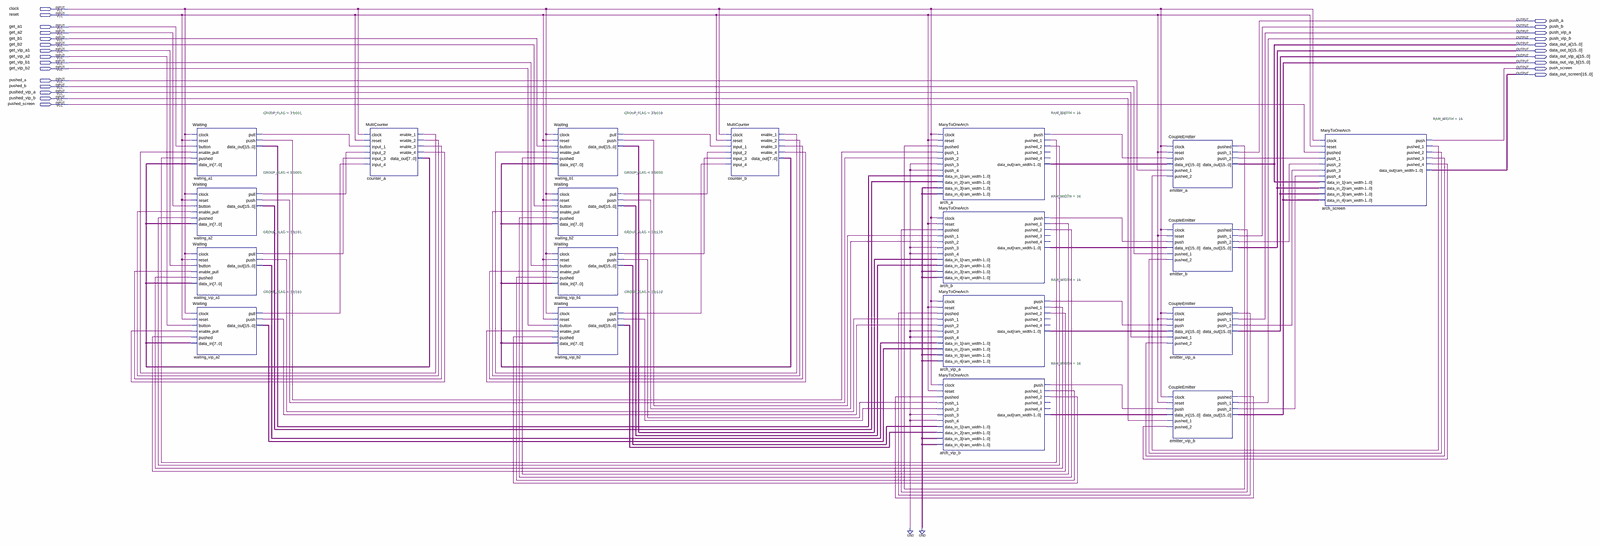
[diagram p0: schematic sheet, whole]
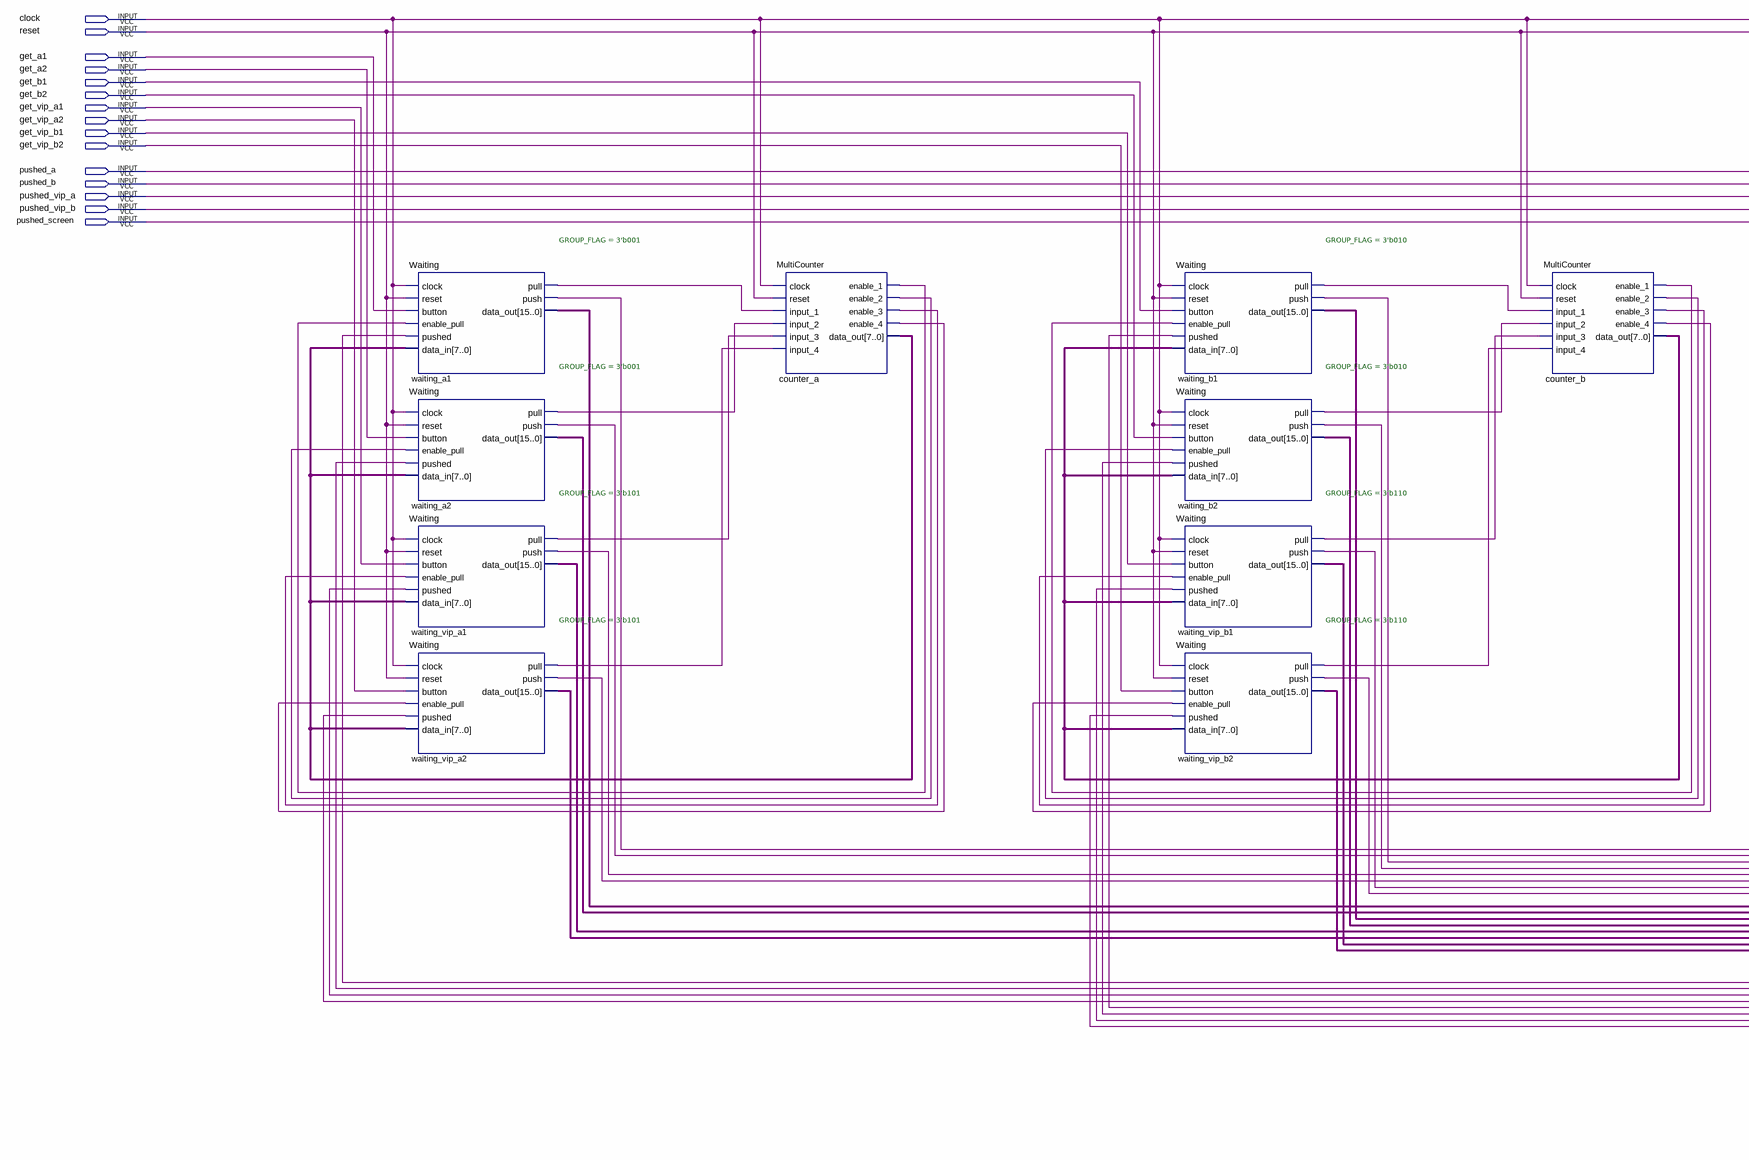
[diagram p1: schematic sheet, left part]
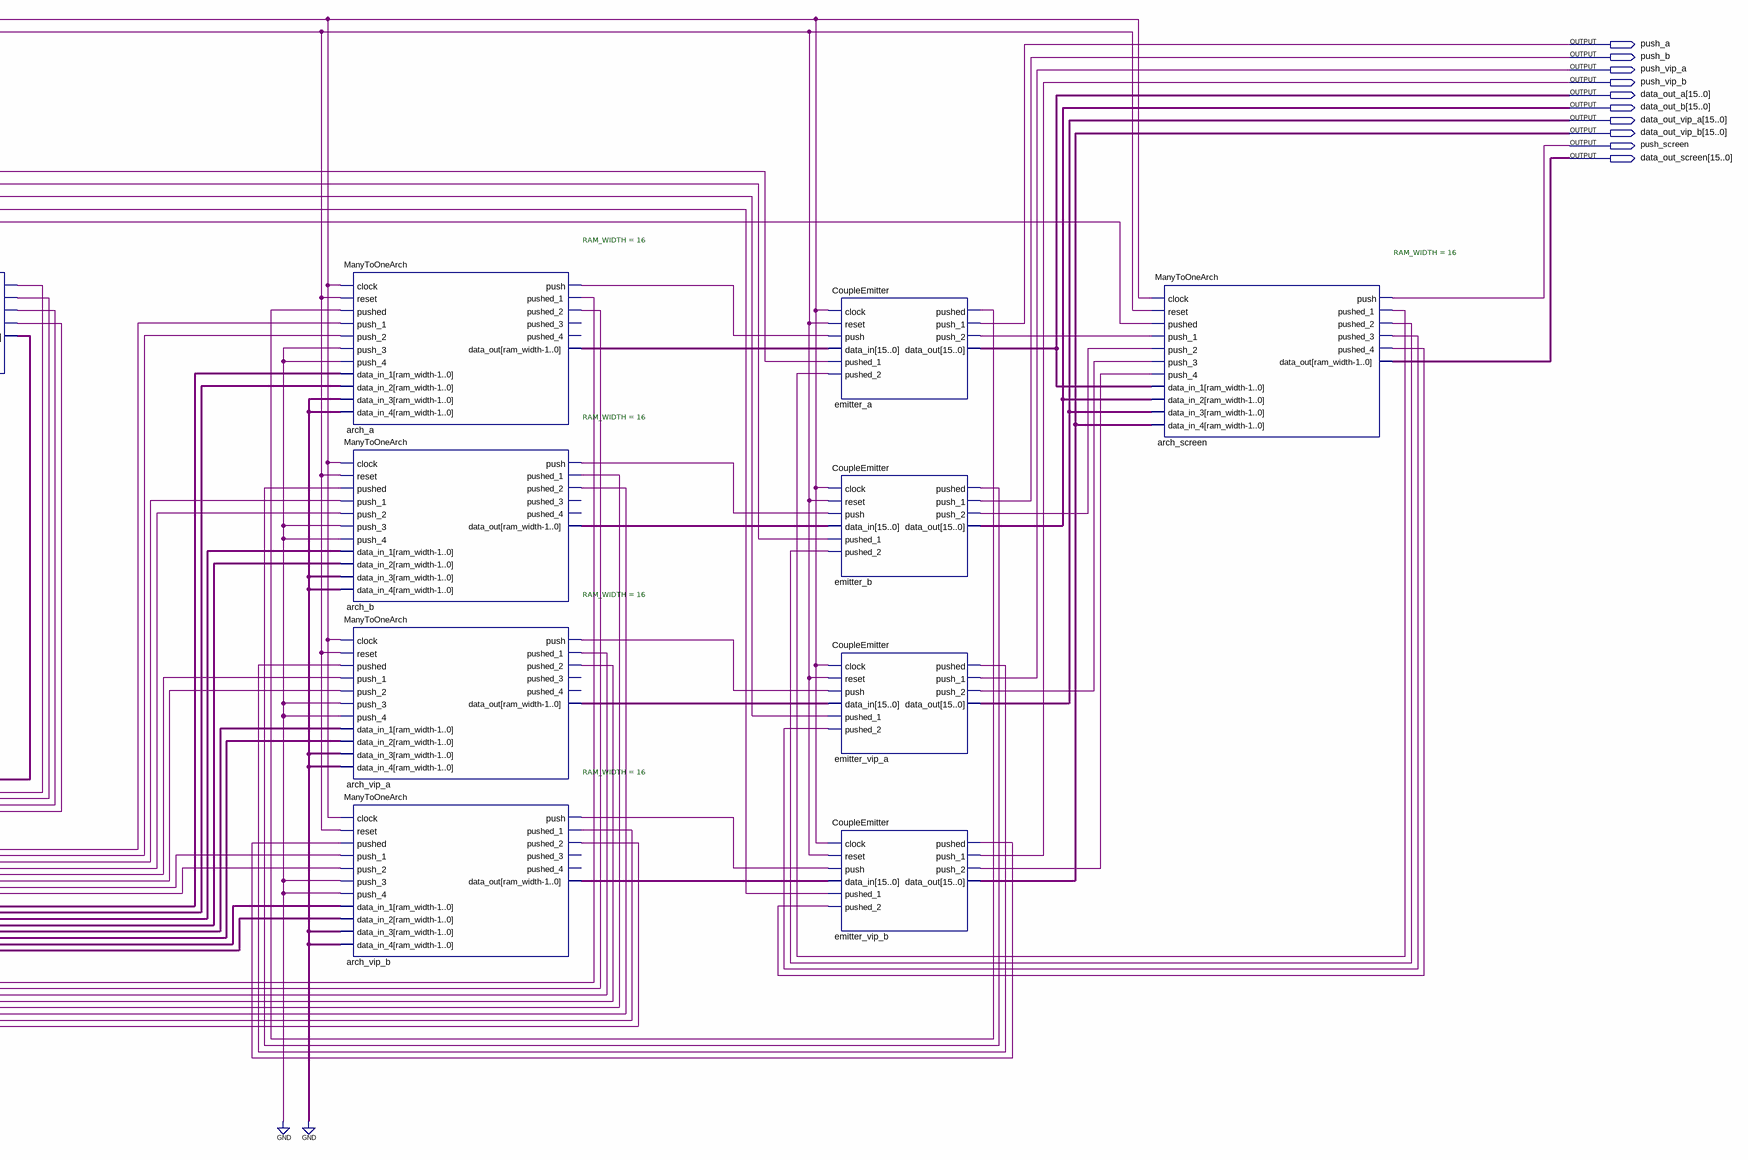
[diagram p2: schematic sheet, right part]
// Quartus schematic TheWaitings.bdf as structural Verilog: 19 symbols, 25 pins
module TheWaitings (
  input  clock,
  input  reset,
  input  get_a1,
  input  get_a2,
  input  get_b1,
  input  get_b2,
  input  get_vip_a1,
  input  get_vip_a2,
  input  get_vip_b1,
  input  get_vip_b2,
  input  pushed_a,
  input  pushed_b,
  input  pushed_vip_a,
  input  pushed_vip_b,
  input  pushed_screen,
  output push_a,
  output push_b,
  output push_vip_a,
  output push_vip_b,
  output [15:0] data_out_a,
  output [15:0] data_out_b,
  output [15:0] data_out_vip_a,
  output [15:0] data_out_vip_b,
  output push_screen,
  output [15:0] data_out_screen
);

  wire arch_a_push, arch_a_pushed_1, arch_a_pushed_2, arch_b_push, arch_b_pushed_1, arch_b_pushed_2,
       arch_screen_pushed_1, arch_screen_pushed_2, arch_screen_pushed_3, arch_screen_pushed_4,
       arch_vip_a_push, arch_vip_a_pushed_1, arch_vip_a_pushed_2, arch_vip_b_push, arch_vip_b_pushed_1,
       arch_vip_b_pushed_2, counter_a_enable_1, counter_a_enable_2, counter_a_enable_3, counter_a_enable_4,
       counter_b_enable_1, counter_b_enable_2, counter_b_enable_3, counter_b_enable_4, emitter_a_push_2,
       emitter_a_pushed, emitter_b_push_2, emitter_b_pushed, emitter_vip_a_push_2, emitter_vip_a_pushed,
       emitter_vip_b_push_2, emitter_vip_b_pushed, waiting_a1_pull, waiting_a1_push, waiting_a2_pull,
       waiting_a2_push, waiting_b1_pull, waiting_b1_push, waiting_b2_pull, waiting_b2_push,
       waiting_vip_a1_pull, waiting_vip_a1_push, waiting_vip_a2_pull, waiting_vip_a2_push,
       waiting_vip_b1_pull, waiting_vip_b1_push, waiting_vip_b2_pull, waiting_vip_b2_push;
  wire [7:0] counter_a_data_out, counter_b_data_out;
  wire [15:0] arch_a_data_out, arch_b_data_out, arch_vip_a_data_out, arch_vip_b_data_out,
       waiting_a1_data_out, waiting_a2_data_out, waiting_b1_data_out, waiting_b2_data_out,
       waiting_vip_a1_data_out, waiting_vip_a2_data_out, waiting_vip_b1_data_out, waiting_vip_b2_data_out;

  Waiting #(.GROUP_FLAG(3'b001)) waiting_a1 (
    .clock(clock), .reset(reset), .button(get_a1), .enable_pull(counter_a_enable_1),
    .pushed(arch_a_pushed_1), .data_in(counter_a_data_out), .pull(waiting_a1_pull), .push(waiting_a1_push),
    .data_out(waiting_a1_data_out));
  Waiting #(.GROUP_FLAG(3'b001)) waiting_a2 (
    .clock(clock), .reset(reset), .button(get_a2), .enable_pull(counter_a_enable_2),
    .pushed(arch_a_pushed_2), .data_in(counter_a_data_out), .pull(waiting_a2_pull), .push(waiting_a2_push),
    .data_out(waiting_a2_data_out));
  Waiting #(.GROUP_FLAG(3'b101)) waiting_vip_a1 (
    .clock(clock), .reset(reset), .button(get_vip_a1), .enable_pull(counter_a_enable_3),
    .pushed(arch_vip_a_pushed_1), .data_in(counter_a_data_out), .pull(waiting_vip_a1_pull),
    .push(waiting_vip_a1_push), .data_out(waiting_vip_a1_data_out));
  Waiting #(.GROUP_FLAG(3'b101)) waiting_vip_a2 (
    .clock(clock), .reset(reset), .button(get_vip_a2), .enable_pull(counter_a_enable_4),
    .pushed(arch_vip_a_pushed_2), .data_in(counter_a_data_out), .pull(waiting_vip_a2_pull),
    .push(waiting_vip_a2_push), .data_out(waiting_vip_a2_data_out));
  MultiCounter counter_a (
    .clock(clock), .reset(reset), .input_1(waiting_a1_pull), .input_2(waiting_a2_pull),
    .input_3(waiting_vip_a1_pull), .input_4(waiting_vip_a2_pull), .enable_1(counter_a_enable_1),
    .enable_2(counter_a_enable_2), .enable_3(counter_a_enable_3), .enable_4(counter_a_enable_4),
    .data_out(counter_a_data_out));
  Waiting #(.GROUP_FLAG(3'b010)) waiting_b1 (
    .clock(clock), .reset(reset), .button(get_b1), .enable_pull(counter_b_enable_1),
    .pushed(arch_b_pushed_1), .data_in(counter_b_data_out), .pull(waiting_b1_pull), .push(waiting_b1_push),
    .data_out(waiting_b1_data_out));
  Waiting #(.GROUP_FLAG(3'b010)) waiting_b2 (
    .clock(clock), .reset(reset), .button(get_b2), .enable_pull(counter_b_enable_2),
    .pushed(arch_b_pushed_2), .data_in(counter_b_data_out), .pull(waiting_b2_pull), .push(waiting_b2_push),
    .data_out(waiting_b2_data_out));
  Waiting #(.GROUP_FLAG(3'b110)) waiting_vip_b1 (
    .clock(clock), .reset(reset), .button(get_vip_b1), .enable_pull(counter_b_enable_3),
    .pushed(arch_vip_b_pushed_1), .data_in(counter_b_data_out), .pull(waiting_vip_b1_pull),
    .push(waiting_vip_b1_push), .data_out(waiting_vip_b1_data_out));
  Waiting #(.GROUP_FLAG(3'b110)) waiting_vip_b2 (
    .clock(clock), .reset(reset), .button(get_vip_b2), .enable_pull(counter_b_enable_4),
    .pushed(arch_vip_b_pushed_2), .data_in(counter_b_data_out), .pull(waiting_vip_b2_pull),
    .push(waiting_vip_b2_push), .data_out(waiting_vip_b2_data_out));
  MultiCounter counter_b (
    .clock(clock), .reset(reset), .input_1(waiting_b1_pull), .input_2(waiting_b2_pull),
    .input_3(waiting_vip_b1_pull), .input_4(waiting_vip_b2_pull), .enable_1(counter_b_enable_1),
    .enable_2(counter_b_enable_2), .enable_3(counter_b_enable_3), .enable_4(counter_b_enable_4),
    .data_out(counter_b_data_out));
  ManyToOneArch #(.RAM_WIDTH(16)) arch_a (
    .clock(clock), .reset(reset), .pushed(emitter_a_pushed), .push_1(waiting_a1_push),
    .push_2(waiting_a2_push), .push_3(1'b0), .push_4(1'b0), .data_in_1(waiting_a1_data_out),
    .data_in_2(waiting_a2_data_out), .data_in_3({16{1'b0}}), .data_in_4({16{1'b0}}), .push(arch_a_push),
    .pushed_1(arch_a_pushed_1), .pushed_2(arch_a_pushed_2), .data_out(arch_a_data_out));  // open: pushed_3, pushed_4
  ManyToOneArch #(.RAM_WIDTH(16)) arch_b (
    .clock(clock), .reset(reset), .pushed(emitter_b_pushed), .push_1(waiting_b1_push),
    .push_2(waiting_b2_push), .push_3(1'b0), .push_4(1'b0), .data_in_1(waiting_b1_data_out),
    .data_in_2(waiting_b2_data_out), .data_in_3({16{1'b0}}), .data_in_4({16{1'b0}}), .push(arch_b_push),
    .pushed_1(arch_b_pushed_1), .pushed_2(arch_b_pushed_2), .data_out(arch_b_data_out));  // open: pushed_3, pushed_4
  ManyToOneArch #(.RAM_WIDTH(16)) arch_vip_a (
    .clock(clock), .reset(reset), .pushed(emitter_vip_a_pushed), .push_1(waiting_vip_a1_push),
    .push_2(waiting_vip_a2_push), .push_3(1'b0), .push_4(1'b0), .data_in_1(waiting_vip_a1_data_out),
    .data_in_2(waiting_vip_a2_data_out), .data_in_3({16{1'b0}}), .data_in_4({16{1'b0}}),
    .push(arch_vip_a_push), .pushed_1(arch_vip_a_pushed_1), .pushed_2(arch_vip_a_pushed_2),
    .data_out(arch_vip_a_data_out));  // open: pushed_3, pushed_4
  ManyToOneArch #(.RAM_WIDTH(16)) arch_vip_b (
    .clock(clock), .reset(reset), .pushed(emitter_vip_b_pushed), .push_1(waiting_vip_b1_push),
    .push_2(waiting_vip_b2_push), .push_3(1'b0), .push_4(1'b0), .data_in_1(waiting_vip_b1_data_out),
    .data_in_2(waiting_vip_b2_data_out), .data_in_3({16{1'b0}}), .data_in_4({16{1'b0}}),
    .push(arch_vip_b_push), .pushed_1(arch_vip_b_pushed_1), .pushed_2(arch_vip_b_pushed_2),
    .data_out(arch_vip_b_data_out));  // open: pushed_3, pushed_4
  CoupleEmitter emitter_a (
    .clock(clock), .reset(reset), .push(arch_a_push), .data_in(arch_a_data_out), .pushed_1(pushed_a),
    .pushed_2(arch_screen_pushed_1), .pushed(emitter_a_pushed), .push_1(push_a), .push_2(emitter_a_push_2),
    .data_out(data_out_a));
  CoupleEmitter emitter_b (
    .clock(clock), .reset(reset), .push(arch_b_push), .data_in(arch_b_data_out), .pushed_1(pushed_b),
    .pushed_2(arch_screen_pushed_2), .pushed(emitter_b_pushed), .push_1(push_b), .push_2(emitter_b_push_2),
    .data_out(data_out_b));
  CoupleEmitter emitter_vip_a (
    .clock(clock), .reset(reset), .push(arch_vip_a_push), .data_in(arch_vip_a_data_out),
    .pushed_1(pushed_vip_a), .pushed_2(arch_screen_pushed_3), .pushed(emitter_vip_a_pushed),
    .push_1(push_vip_a), .push_2(emitter_vip_a_push_2), .data_out(data_out_vip_a));
  CoupleEmitter emitter_vip_b (
    .clock(clock), .reset(reset), .push(arch_vip_b_push), .data_in(arch_vip_b_data_out),
    .pushed_1(pushed_vip_b), .pushed_2(arch_screen_pushed_4), .pushed(emitter_vip_b_pushed),
    .push_1(push_vip_b), .push_2(emitter_vip_b_push_2), .data_out(data_out_vip_b));
  ManyToOneArch #(.RAM_WIDTH(16)) arch_screen (
    .clock(clock), .reset(reset), .pushed(pushed_screen), .push_1(emitter_a_push_2),
    .push_2(emitter_b_push_2), .push_3(emitter_vip_a_push_2), .push_4(emitter_vip_b_push_2),
    .data_in_1(data_out_a), .data_in_2(data_out_b), .data_in_3(data_out_vip_a), .data_in_4(data_out_vip_b),
    .push(push_screen), .pushed_1(arch_screen_pushed_1), .pushed_2(arch_screen_pushed_2),
    .pushed_3(arch_screen_pushed_3), .pushed_4(arch_screen_pushed_4), .data_out(data_out_screen));
endmodule
